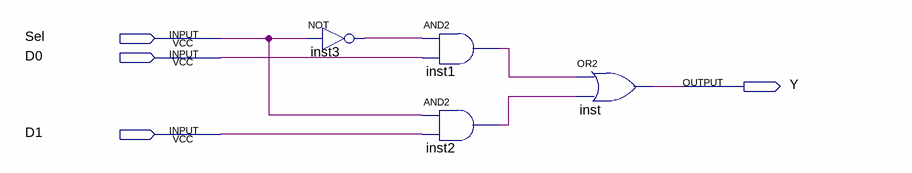
[diagram p0: schematic sheet]
// Quartus schematic MUX2TO1.bdf as structural Verilog: 4 symbols, 4 pins
module MUX2TO1 (
  input  Sel,
  input  D0,
  input  D1,
  output Y
);

  wire inst1_out, inst2_out, inst3_out;

  not inst3 (inst3_out, Sel);
  and inst1 (inst1_out, inst3_out, D0);
  and inst2 (inst2_out, Sel, D1);
  or inst (Y, inst1_out, inst2_out);
endmodule
